# EAGLE design YOLOTL (EAGLE 6.5.0)
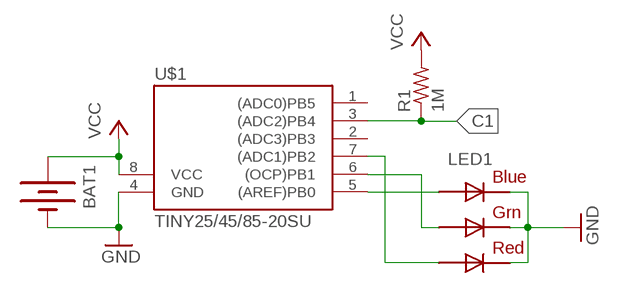
[diagram p0: schematic, sheet 1]

## Parts
BAT1  BATTERY20PTH  [BATTCOM_20MM_PTH]
LED1  RGBLED5050  [RGBLED5050]
R1  1M  R-US_R1206  [R1206]
U$1  TINY25/45/85-20SU  [SOIC8]

## Nets
C1: R1.1 U$1.3((ADC2)PB4)
GND: BAT1.2(-) LED1.4(BLUE_C) LED1.5(RED_C) LED1.6(GREEN_C) U$1.4(GND)
N$1: LED1.2(RED_A) U$1.7((ADC1)PB2)
N$2: LED1.3(BLUE_A) U$1.5((AREF)PB0)
N$3: LED1.1(GREEN_A) U$1.6((OCP)PB1)
VCC: BAT1.1(+) R1.2 U$1.8(VCC)
Unconnected: U$1.1((ADC0)PB5) U$1.2((ADC3)PB3)

## Library data of the parts
BAT1 = SparkFun:BATTERY: Battery Holders Various common sizes : AA, AAA, 20mm coin cell and 12mm coin cell.
LED1 = adafruit:RGBLED: For 5050 RGB LEDs, the order of the LEDs may vary from one manufacturer to another!
R1 = adafruit:R-US_: RESISTOR, American symbol
U$1 = avr-7:TINY25/45/85

## Board
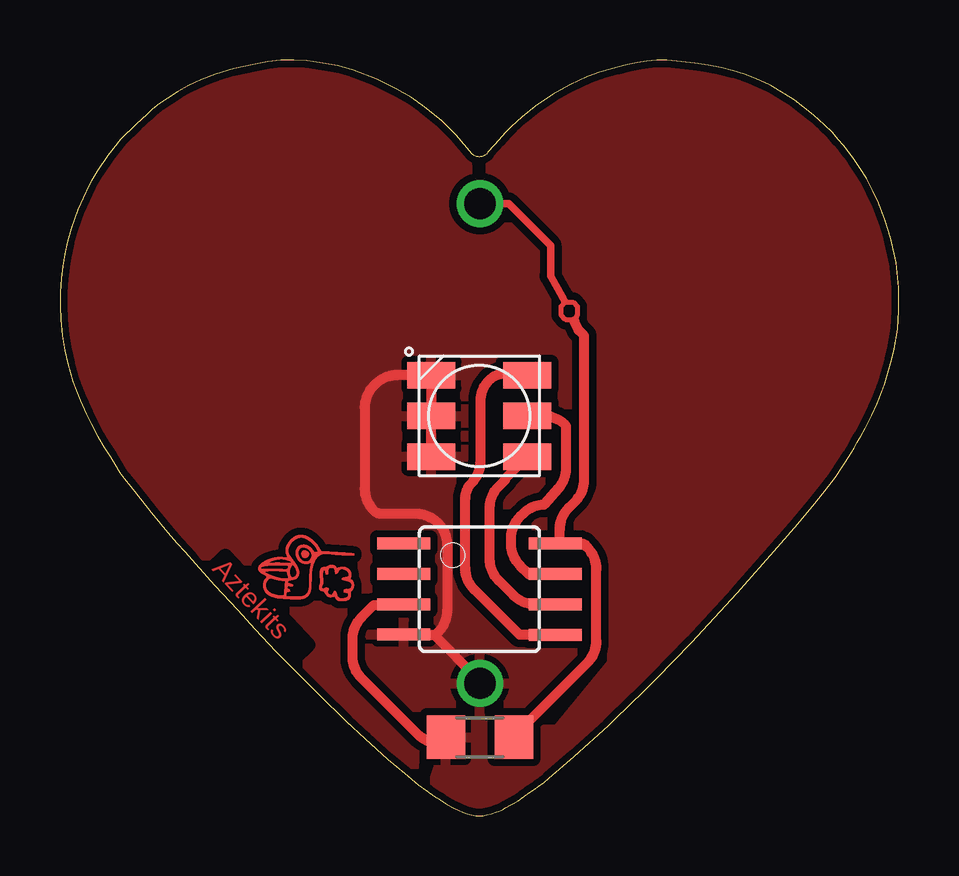
[diagram p1: board, top side]
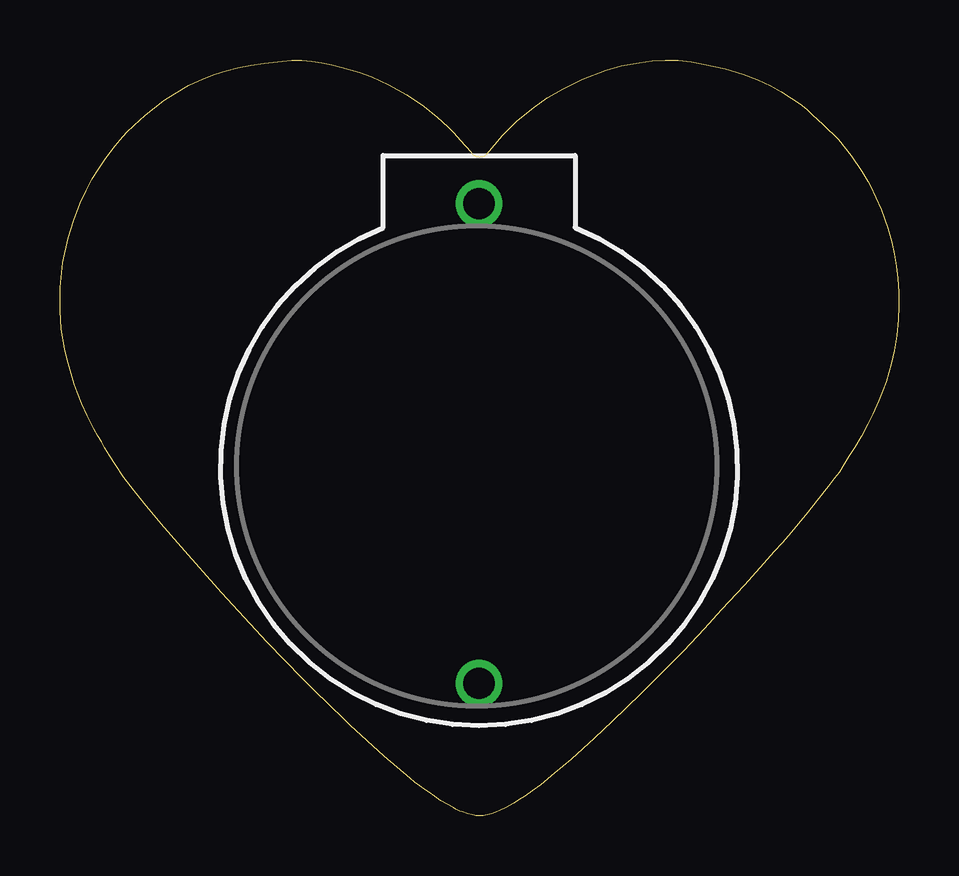
[diagram p2: board, bottom side, seen from below]

Size 34.96 x 31.52 mm. Coordinates in mm from the lower left corner, seen from the top.
Outline: 16.06,0.53 16.39,0.34 16.61,0.23 16.81,0.15 16.97,0.1 17.13,0.06 17.24,0.03 arc35 17.78,0.05 17.98,0.1 18.2,0.17 arc15 18.56,0.34 18.83,0.48 19.09,0.64 19.34,0.82 19.58,0.99 19.75,1.1 arc10 20.37,1.58 21.44,2.49 22.87,3.78 23.11,4.03 24.36,5.23 24.84,5.72 26.32,7.24 28.22,9.29 29.91,11.21 30.75,12.17 31.45,13.02 31.87,13.56 32.3,14.11 32.65,14.65 32.88,15 33.09,15.34 33.22,15.59 33.36,15.82 33.56,16.16 33.83,16.7 34.05,17.19 34.25,17.67 34.37,18 34.66,19.02 34.77,19.47 34.9,20.3 34.96,21.07 34.96,22.03 34.84,23.07 34.62,24.09 34.38,24.82 34.11,25.56 33.87,26.07 33.61,26.57 33.34,26.99 33.1,27.37 32.87,27.67 32.66,27.94 32.44,28.19 32.17,28.5 31.87,28.79 31.41,29.22 31.02,29.53 30.62,29.85 30.17,30.12 29.59,30.46 28.99,30.73 28.51,30.92 28.03,31.07 27.56,31.2 27.02,31.31 26.45,31.39 25.71,31.47 arc24 23.24,31.21 22.49,31 21.97,30.82 21.26,30.49 20.52,30.08 19.81,29.6 19.24,29.14 18.81,28.74 18.55,28.49 18.28,28.18 17.85,27.7 arc-106 17.17,27.6 16.51,28.38 15.91,28.99 15.21,29.55 14.66,29.94 14,30.32 13.2,30.72 12.23,31.1 11.58,31.27 10.82,31.41 arc23 8.13,31.35 7.24,31.16 6.49,30.93 5.88,30.69 5.34,30.44 4.91,30.19 4.49,29.93 4.14,29.69 3.85,29.46 3.63,29.26 3.15,28.83 2.54,28.22 1.99,27.53 1.55,26.89 1.31,26.47 1.2,26.27 0.74,25.27 0.47,24.51 0.31,23.93 0.2,23.42 0.12,22.92 0.06,22.4 arc11 0.03,20.69 0.1,20.03 0.21,19.41 0.33,18.86 0.54,18.12 0.68,17.74 0.85,17.33 1.09,16.76 1.3,16.34 1.57,15.83 1.85,15.37 2.09,14.99 2.29,14.68 2.49,14.33 2.69,14.08 2.95,13.73 3.43,13.14 3.81,12.66 4.2,12.18 4.5,11.83 4.87,11.39 5.22,11 5.49,10.69 5.81,10.34 6.46,9.61 7.4,8.59 8.11,7.8 8.99,6.86 10.76,5.1 11.94,3.94 12.71,3.23 13.66,2.37 14.37,1.77 14.93,1.31 15.28,1.06 15.6,0.83 15.84,0.67 16.06,0.53
Copper layers (1*16): Top 0.035mm / dielectric 1.5mm / Bottom 0.035mm
Design rules "Reglas_v1.1": minimum track width 6mil, minimum drill 12mil, track to track 6mil, track to pad 6mil, pad to pad 6mil, via to via 6mil, smd to smd 0mil, copper to edge 10mil, drill to drill 10mil, minimum pad ring 10mil, minimum via ring 6mil, stop-mask expansion 2mil, vias tented up to drill 100mil, thermal gap 10mil

### Footprints (pad centres in the part's own frame; a part is rotated, then mirrored left to right if it is on the bottom)
BATTCOM_20MM_PTH = drill 1.3: 1 20,0; 2 0,0
RGBLED5050 = smd 2 x 1.1: 1 -2,1.7; 2 -2,0; 3 -2,-1.7; 4 2,-1.7; 5 2,0; 6 2,1.7
R1206 = smd 1.6 x 1.803: 1 -1.422,0; 2 1.422,0
SOIC8 = smd 0.5 x 2.2: 1 -1.905,-3.154; 2 -0.645,-3.154; 3 0.625,-3.154; 4 1.895,-3.154; 5 1.905,3.154; 6 0.635,3.154; 7 -0.635,3.154; 8 -1.905,3.154

### Placement (x,y rotation side)
BAT1  17.5,5.53 90 bottom
LED1  17.48,16.68 180 top
R1  17.5,3.29 0 top
U$1  17.48,9.46 270 top

### Tracks (layer width: path | path; a pad name or v marks a point on that pad's centre or on a via)
C1
  Top 0.406: R1.1 15.81,3.03 arc-45 14.91,3.4 12.56,5.76 arc-45 12.19,6.65 12.19,7.38 arc-45 12.56,8.28 13.08,8.79 14.23,8.79 arc45 U$1.3
  pour Top (isolate 0.305): 15.49,1.17 17.52,-0.22 24.19,4.86 32.26,13.24 34.8,18.32 35.3,21.37 34.8,24.92 32.76,28.48 29.21,31.02 26.16,31.53 23.11,31.53 20.06,30 17.96,27.32 17.65,25.69 19.43,25.56 20.7,23.78 20.57,22.64 22.22,19.59 21.84,13.24 21.08,11.84 22.86,10.32 22.98,6.38 20.7,3.59 18.92,3.59 16.38,3.97
GND
  Top 0.406: BAT1.2 arc45 17.42,5.73 15.62,7.52 | 15.62,7.52 14.36,7.52 U$1.4 | 15.62,7.52 15.75,7.66 arc45 16.13,8.56 16.13,11.32 arc45 15.75,12.21 15.74,12.23 arc45 14.84,12.6 13.4,12.6 arc-45 13.07,12.74 arc-45 12.7,13.64 12.7,17.03 arc-45 13.07,17.93 13.15,18.01 arc-45 14.05,18.38 LED1.4 LED1.5 LED1.6
  pour Top (isolate 0.305): 14.73,1.68 14.98,4.48 20.06,4.1 22.6,6.25 22.73,9.94 21.97,11.33 20.83,11.33 20.7,12.35 21.71,13.37 21.84,14.89 21.71,19.84 20.44,22.64 20.19,23.91 18.54,25.18 17.27,24.16 16.95,27.44 15.24,30 11.68,31.53 7.62,31.53 4.57,30 1.54,26.94 0,22.38 0,19.84 1.01,16.29 3.55,12.73 7.11,8.67 14.73,1.56
N$1
  Top 0.406: U$1.7 19.53,10.09 19.17,10.45 arc-45 18.79,11.35 18.79,11.57 arc-45 19.17,12.47 19.34,12.64 arc-45 20.17,12.99 20.76,13.66 arc41 21.08,14.5 21.08,15.91 21.07,16.3 arc45 20.17,16.67 19.49,16.67 LED1.2
N$2
  Top 0.406: U$1.5 19.15,7.55 17.26,9.44 arc-45 16.89,10.34 16.89,13.25 arc-45 17.15,13.88 arc45 17.52,14.78 17.52,17.29 arc-45 17.9,18.18 arc-45 18.53,18.45 19.41,18.45 LED1.3
N$3
  Top 0.406: U$1.6 19.8,8.82 arc-45 18.9,9.19 18.28,9.82 arc-45 17.9,10.72 17.9,12.84 arc-45 18.28,13.74 18.51,13.97 arc45 18.54,14.05 LED1.1
VCC
  Top 0.203: 21.03,21.44 21.08,21.42 21.38,21.42 21.56,21.24 21.56,20.91 21.47,20.7 | 21.47,20.7 21.44,20.63 | 21.05,21.42 20.88,21.24 20.88,20.88 21.05,20.71 21.47,20.7
  Top 0.305: 21.03,21.44 20.95,21.62 20.44,22.51 20.44,23.78 18.69,25.53 BAT1.1
  Top 0.406: 21.44,20.63 21.61,20.25 21.84,20.02 21.84,14.02 arc-45 21.47,13.12 21.2,12.85 arc45 20.83,11.95 20.83,11.46 20.95,11.33 20.66,11.33 U$1.8 arc45 20.7,11.33 21.84,11.33 21.98,11.2 arc-45 22.35,10.3 22.35,7.29 arc-45 21.98,6.39 18.95,3.37 arc45 R1.2
(copper drawn outside any net)
  shapes: Top area x2956

### Text on the board
Top: Aztekits
tStop: POWERED BY LOVE... | and electrons!
tCream: POWERED BY LOVE... | and electrons!